# Altium schematic sheet UA.SchDoc: UA_V1
size A; DrawnBy: Mr. Thach; Revision: Rev 1.0
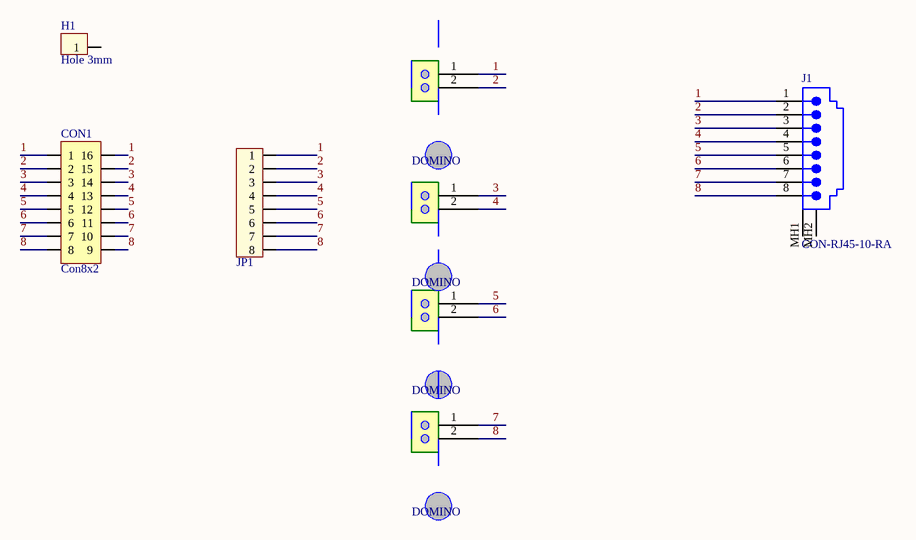
[diagram p0: UA.SchDoc]

## Parts
CON1  Con8x2  [HEAD8x2]
D1  DOMINO  [Domino2_small]
D2  DOMINO  [Domino2_small]
D3  DOMINO  [Domino2_small]
D4  DOMINO  [Domino2_small]
H1  Hole 3mm  [Hole_3mm]
J1  CON-RJ45-10-RA  [RJ45_tme]
JP1  JP8  [CON8]  (value not drawn)

## Nets
1: CON1.1 CON1.16 D1.1 J1.1 JP1.1
2: CON1.2 CON1.15 D1.2 J1.2 JP1.2
3: CON1.3 CON1.14 D2.1 J1.3 JP1.3
4: CON1.4 CON1.13 D2.2 J1.4 JP1.4
5: CON1.5 CON1.12 D3.1 J1.5 JP1.5
6: CON1.6 CON1.11 D3.2 J1.6 JP1.6
7: CON1.7 CON1.10 D4.1 J1.7 JP1.7
8: CON1.8 CON1.9 D4.2 J1.8 JP1.8

Not connected (* = marked no-connect by the designer): H1 1; J1 MH1(Shield) MH2(Shield)

## Library data of the parts
D1-D4 = Domino 2
H1 = Hole_3mm
J1 = CON-RJ45-10-RA: Right Angle, Standard Profile, External Shield PCB Jack
JP1 = Con8: Connector 8; Value: Connector 8